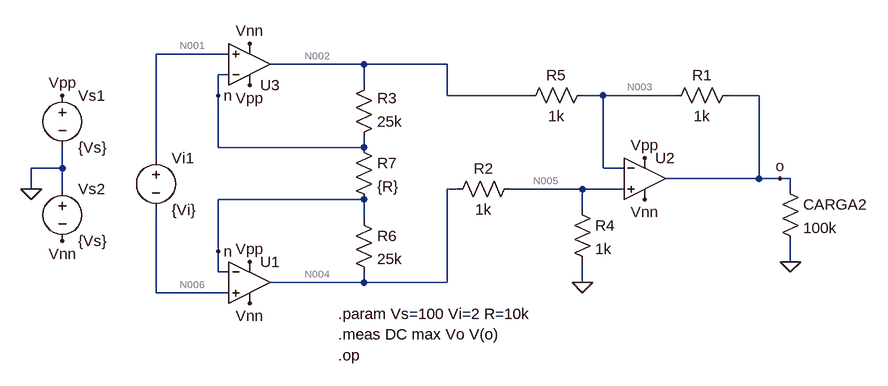
[diagram p0: schematic ex2.asc]
ex2.asc, the LTspice schematic file:
Version 4
SHEET 1 1240 680
WIRE 176 -192 64 -192
WIRE 384 -176 240 -176
WIRE 512 -176 384 -176
WIRE 176 -160 160 -160
WIRE 384 -144 384 -176
WIRE 160 -128 160 -160
WIRE 512 -128 512 -176
WIRE 640 -128 512 -128
WIRE 752 -128 720 -128
WIRE 864 -128 752 -128
WIRE 992 -128 944 -128
WIRE 160 -48 160 -128
WIRE 384 -48 384 -64
WIRE 384 -48 160 -48
WIRE 64 -32 64 -192
WIRE -80 -16 -80 -48
WIRE -80 -16 -128 -16
WIRE 752 -16 752 -128
WIRE 784 -16 752 -16
WIRE 992 0 992 -128
WIRE 992 0 848 0
WIRE 1024 0 992 0
WIRE 1040 0 1024 0
WIRE -128 16 -128 -16
WIRE -80 16 -80 -16
WIRE 528 16 512 16
WIRE 720 16 608 16
WIRE 784 16 720 16
WIRE 1040 16 1040 0
WIRE 384 32 160 32
WIRE 720 48 720 16
WIRE 384 64 384 32
WIRE 160 112 160 32
WIRE 1040 128 1040 96
WIRE 160 144 160 112
WIRE 176 144 160 144
WIRE 384 160 384 144
WIRE 384 160 240 160
WIRE 512 160 512 16
WIRE 512 160 384 160
WIRE 720 160 720 128
WIRE 64 176 64 48
WIRE 176 176 64 176
FLAG -128 16 0
FLAG -80 -128 Vpp
FLAG -80 96 Vnn
FLAG 208 128 Vpp
FLAG 208 192 Vnn
FLAG 160 112 n
FLAG 1040 128 0
FLAG 1024 0 o
FLAG 816 -32 Vpp
FLAG 816 32 Vnn
FLAG 720 160 0
FLAG 208 -144 Vpp
FLAG 208 -208 Vnn
FLAG 160 -128 n
SYMBOL voltage 64 -48 R0
SYMATTR InstName Vi1
SYMATTR Value {Vi}
SYMBOL OpAmps\\UniversalOpAmp2 208 160 R0
SYMATTR InstName U1
SYMATTR Value2 Avol=125 GBW=10Meg Slew=10Meg
SYMBOL voltage -80 -144 R0
SYMATTR InstName Vs1
SYMATTR Value {Vs}
SYMBOL voltage -80 0 R0
SYMATTR InstName Vs2
SYMATTR Value {Vs}
SYMBOL res 960 -144 R90
WINDOW 0 0 56 VBottom 2
WINDOW 3 32 56 VTop 2
SYMATTR InstName R1
SYMATTR Value 1k
SYMBOL OpAmps\\UniversalOpAmp2 816 0 R0
SYMATTR InstName U2
SYMATTR Value2 Avol=125 GBW=10Meg Slew=10Meg
SYMBOL res 1024 0 R0
SYMATTR InstName CARGA2
SYMATTR Value 100k
SYMBOL res 624 0 R90
WINDOW 0 0 56 VBottom 2
WINDOW 3 32 56 VTop 2
SYMATTR InstName R2
SYMATTR Value 1k
SYMBOL res 704 32 R0
SYMATTR InstName R4
SYMATTR Value 1k
SYMBOL res 736 -144 R90
WINDOW 0 0 56 VBottom 2
WINDOW 3 32 56 VTop 2
SYMATTR InstName R5
SYMATTR Value 1k
SYMBOL OpAmps\\UniversalOpAmp2 208 -176 M180
SYMATTR InstName U3
SYMATTR Value2 Avol=125 GBW=10Meg Slew=10Meg
SYMBOL res 368 -48 M180
WINDOW 0 36 76 Left 2
WINDOW 3 36 40 Left 2
SYMATTR InstName R3
SYMATTR Value 25k
SYMBOL res 368 48 R0
SYMATTR InstName R6
SYMATTR Value 25k
SYMBOL res 368 -64 R0
SYMATTR InstName R7
SYMATTR Value {R}
TEXT 344 208 Left 2 !.param Vs=100 Vi=2 R=10k
TEXT 344 272 Left 2 !.op
TEXT 344 240 Left 2 !.meas DC max Vo V(o)

The netlist it stands for:
* ex2.asc
Vi1 N001 N006 {Vi}
XU1 N006 n Vpp Vnn N004 level2 Avol=125 GBW=10Meg Slew=10Meg Ilimit=25m Rail=0 Vos=0 En=0 Enk=0 In=0 Ink=0 Rin=500Meg  ; pins In+ In- V+ V- OUT
Vs1 Vpp 0 {Vs}
Vs2 0 Vnn {Vs}
R1 o N003 1k
XU2 N005 N003 Vpp Vnn o level2 Avol=125 GBW=10Meg Slew=10Meg Ilimit=25m Rail=0 Vos=0 En=0 Enk=0 In=0 Ink=0 Rin=500Meg  ; pins In+ In- V+ V- OUT
R§CARGA2 o 0 100k
R2 N005 N004 1k
R4 N005 0 1k
R5 N003 N002 1k
XU3 N001 n Vpp Vnn N002 level2 Avol=125 GBW=10Meg Slew=10Meg Ilimit=25m Rail=0 Vos=0 En=0 Enk=0 In=0 Ink=0 Rin=500Meg  ; pins In+ In- V+ V- OUT
R3 n N002 25k
R6 n N004 25k
R7 n n {R}
.param Vs=100 Vi=2 R=10k
.op
.meas DC max Vo V(o)
.lib UniversalOpAmp2.lib
.backanno
.end

* Results of the author's LTspice run, read from the files saved beside the schematic
* Operating Point:
*   V(n001) = 1 V
*   V(n006) = -1 V
*   V(n004) = -19.87 V
*   V(vpp) = 100 V
*   V(vnn) = -100 V
*   V(n) = -9.406 mV
*   V(o) = -19.86 V
*   V(n003) = -932.1 µV
*   V(n005) = -9.936 V
*   V(n002) = 19.85 V
*   I(R1) = -19.85 mA
*   I(Carga2) = -198.6 µA
*   I(R2) = 9.936 mA
*   I(R4) = -9.936 mA
*   I(R5) = -19.85 mA
*   I(R3) = -794.5 µA
*   I(R6) = 794.5 µA
*   I(Vi1) = -2 nA
*   I(Vs1) = -30.69 mA
*   I(Vs2) = -40.82 mA
*   Ix(u1:1) = -2 nA
*   Ix(u1:2) = -18.81 pA
*   Ix(u1:3) = 5.082 mA
*   Ix(u1:4) = -15.81 mA
*   Ix(u1:5) = 10.73 mA
*   Ix(u2:1) = -19.87 nA
*   Ix(u2:2) = -1.864 pA
*   Ix(u2:3) = 2.56 mA
*   Ix(u2:4) = -22.61 mA
*   Ix(u2:5) = 20.05 mA
*   Ix(u3:1) = 2 nA
*   Ix(u3:2) = -18.81 pA
*   Ix(u3:3) = 23.04 mA
*   Ix(u3:4) = -2.394 mA
*   Ix(u3:5) = -20.65 mA
* From the log:
*   Semiconductor Device Operating Points:
*                           --- Diodes ---
*   Name:    d:u1:1      d:u1:2      d:u2:1      d:u2:2      d:u3:1
*   Model:    u1:x        u1:x        u2:x        u2:x        u3:x
*   Id:     -1.20e-10   -8.02e-11   -1.20e-10   -8.02e-11   -8.02e-11
*   Vd:     -1.20e+02   -8.01e+01   -1.20e+02   -8.01e+01   -8.01e+01
*   Req:     1.00e-12    1.00e-12    1.00e-12    1.00e-12    1.00e-12
*   CAP:     0.00e+00    0.00e+00    0.00e+00    0.00e+00    0.00e+00
*   Name:    d:u3:2
*   Model:    u3:x
*   Id:     -1.20e-10
*   Vd:     -1.20e+02
*   Req:     1.00e-12
*   CAP:     0.00e+00